# Altium schematic sheet Slave3_flying_pcb_v1.SchDoc
size A4
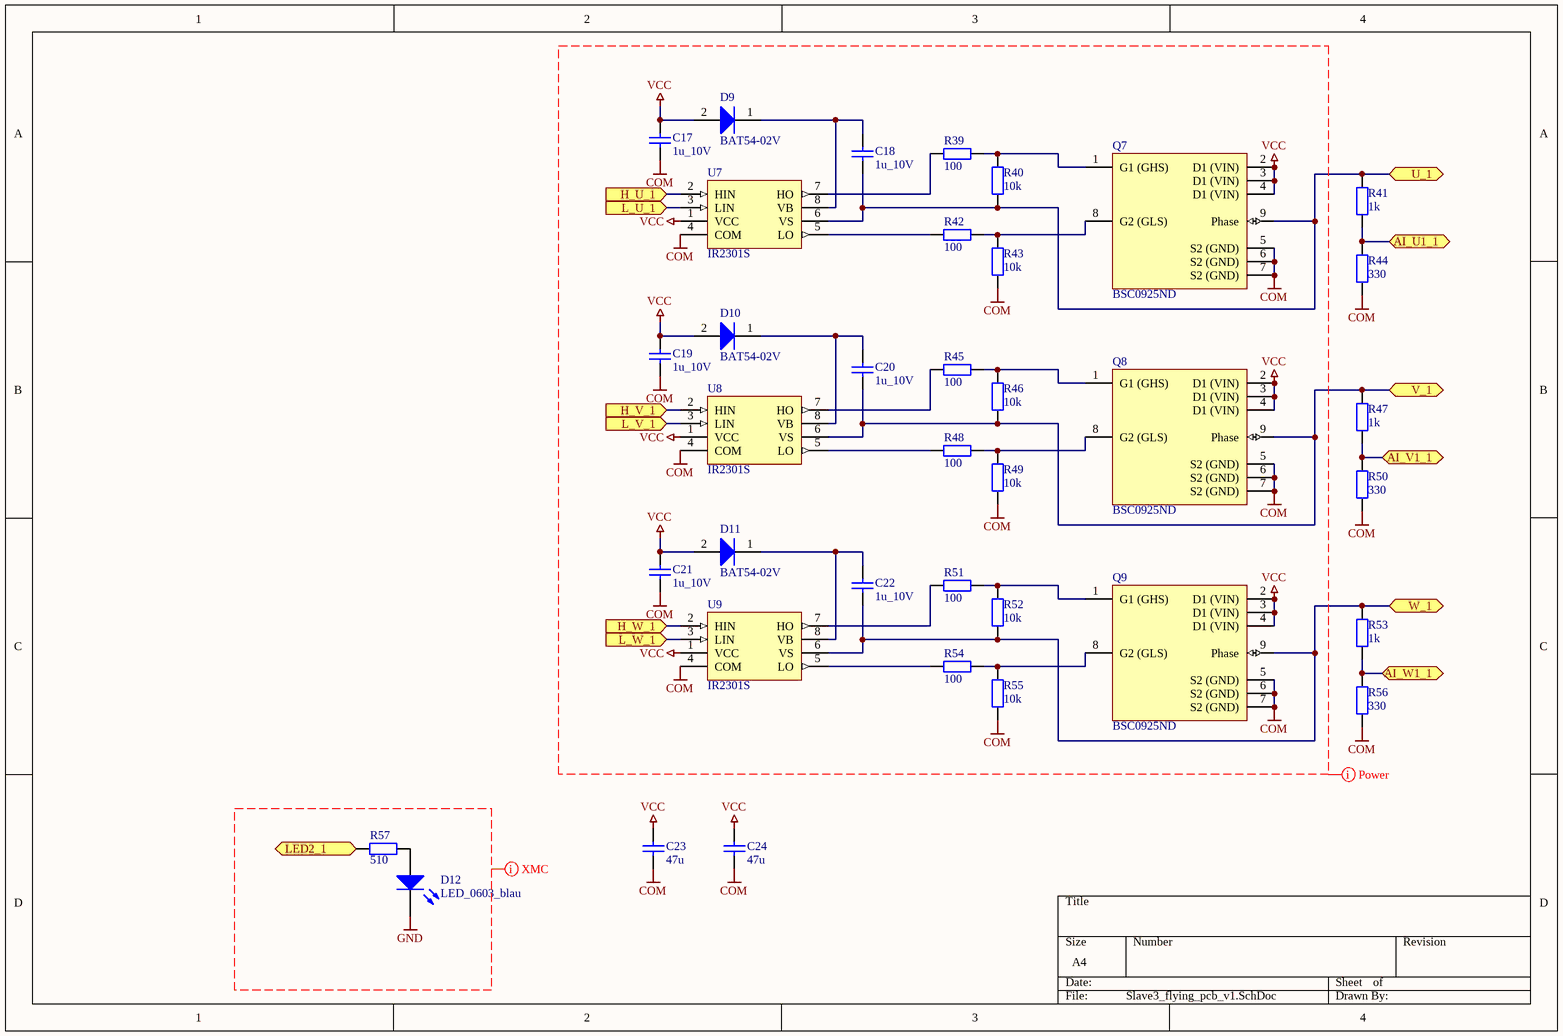
[diagram p0: Slave3_flying_pcb_v1.SchDoc]

## Parts
C17  1u_10V  [1608[0603]]
C18  1u_10V  [1608[0603]]
C19  1u_10V  [1608[0603]]
C20  1u_10V  [1608[0603]]
C21  1u_10V  [1608[0603]]
C22  1u_10V  [1608[0603]]
C23  47u  [_0805]
C24  47u  [_0805]
D9  BAT54-02V  [INF-SC79_V]
D10  BAT54-02V  [INF-SC79_V]
D11  BAT54-02V  [INF-SC79_V]
D12  LED_0603_blau  [LED_0603]
Q7  BSC0925ND  [INF-PG-TISON-8_V]
Q8  BSC0925ND  [INF-PG-TISON-8_V]
Q9  BSC0925ND  [INF-PG-TISON-8_V]
R39  value 100  [1608[0603]]  (hidden comment: Res_0603)
R40  value 10k  [1608[0603]]  (hidden comment: Res_0603)
R41  value 1k  [1608[0603]]  (hidden comment: Res_0603)
R42  value 100  [1608[0603]]  (hidden comment: Res_0603)
R43  value 10k  [1608[0603]]  (hidden comment: Res_0603)
R44  value 330  [1608[0603]]  (hidden comment: Res_0603)
R45  value 100  [1608[0603]]  (hidden comment: Res_0603)
R46  value 10k  [1608[0603]]  (hidden comment: Res_0603)
R47  value 1k  [1608[0603]]  (hidden comment: Res_0603)
R48  value 100  [1608[0603]]  (hidden comment: Res_0603)
R49  value 10k  [1608[0603]]  (hidden comment: Res_0603)
R50  value 330  [1608[0603]]  (hidden comment: Res_0603)
R51  value 100  [1608[0603]]  (hidden comment: Res_0603)
R52  value 10k  [1608[0603]]  (hidden comment: Res_0603)
R53  value 1k  [1608[0603]]  (hidden comment: Res_0603)
R54  value 100  [1608[0603]]  (hidden comment: Res_0603)
R55  value 10k  [1608[0603]]  (hidden comment: Res_0603)
R56  value 330  [1608[0603]]  (hidden comment: Res_0603)
R57  value 510  [1608[0603]]  (hidden comment: Res_0603)
U7  IR2301S  [SO-8_N]
U8  IR2301S  [SO-8_N]
U9  IR2301S  [SO-8_N]

## Ports
AI_U1_1 (bidir), AI_V1_1 (bidir), AI_W1_1 (bidir), H_U_1, H_V_1, H_W_1, L_U_1, L_V_1, L_W_1, LED2_1, U_1 (bidir), V_1 (bidir), W_1 (bidir)

## Nets
COM: C17.2 C19.2 C21.2 C23.1 C24.1 Q7.5(S2_(GND)) Q7.6(S2_(GND)) Q7.7(S2_(GND)) Q8.5(S2_(GND)) Q8.6(S2_(GND)) Q8.7(S2_(GND)) Q9.5(S2_(GND)) Q9.6(S2_(GND)) Q9.7(S2_(GND)) R43.2 R44.2 R49.2 R50.2 R55.2 R56.2 U7.4(COM) U8.4(COM) U9.4(COM)
GND: D12.2
VCC: C17.1 C19.1 C21.1 C23.2 C24.2 D9.2(A) D10.2(A) D11.2(A) Q7.2(D1_(VIN)) Q7.3(D1_(VIN)) Q7.4(D1_(VIN)) Q8.2(D1_(VIN)) Q8.3(D1_(VIN)) Q8.4(D1_(VIN)) Q9.2(D1_(VIN)) Q9.3(D1_(VIN)) Q9.4(D1_(VIN)) U7.1(VCC) U8.1(VCC) U9.1(VCC)
AI_U1_1: R41.2 R44.1 ; port AI_U1_1
AI_V1_1: R47.2 R50.1 ; port AI_V1_1
AI_W1_1: R53.2 R56.1 ; port AI_W1_1
H_U_1: U7.2(HIN) ; port H_U_1
H_V_1: U8.2(HIN) ; port H_V_1
H_W_1: U9.2(HIN) ; port H_W_1
L_U_1: U7.3(LIN) ; port L_U_1
L_V_1: U8.3(LIN) ; port L_V_1
L_W_1: U9.3(LIN) ; port L_W_1
LED2_1: R57.1 ; port LED2_1
U_1: C18.2 Q7.9(Phase) R40.2 R41.1 U7.6(VS) ; port U_1
V_1: C20.2 Q8.9(Phase) R46.2 R47.1 U8.6(VS) ; port V_1
W_1: C22.2 Q9.9(Phase) R52.2 R53.1 U9.6(VS) ; port W_1
NetC18_1: C18.1 D9.1(K) U7.8(VB)
NetC20_1: C20.1 D10.1(K) U8.8(VB)
NetC22_1: C22.1 D11.1(K) U9.8(VB)
NetD12_1: D12.1 R57.2
NetQ7_1: Q7.1(G1_(GHS)) R39.1 R40.1
NetQ7_8: Q7.8(G2_(GLS)) R42.1 R43.1
NetQ8_1: Q8.1(G1_(GHS)) R45.1 R46.1
NetQ8_8: Q8.8(G2_(GLS)) R48.1 R49.1
NetQ9_1: Q9.1(G1_(GHS)) R51.1 R52.1
NetQ9_8: Q9.8(G2_(GLS)) R54.1 R55.1
NetR39_2: R39.2 U7.7(HO)
NetR42_2: R42.2 U7.5(LO)
NetR45_2: R45.2 U8.7(HO)
NetR48_2: R48.2 U8.5(LO)
NetR51_2: R51.2 U9.7(HO)
NetR54_2: R54.2 U9.5(LO)

## Layout directives
net class Power: COM, VCC
net class XMC: GND

## Library data of the parts
C17-C22 = Cap_133: RS_number: 788-2884; QR: 0; Capacity: 1u; Voltage: 10V; UID: Cap_133; Name: 1u_10V; Name_Hyperlink: http://at.rs-online.com/web/p/keramik-multilayer-kondensatoren/7882884; ComponentLink1URL: #NAME?; mounting: SMD
C23 C24 = Cap_133: Name: Cap_cer_1u_50V; Capacity: 1u; Voltage: 50V; RS_number: 723-6350; QR: 0; UID: Cap_133; ComponentLink1URL: #NAME?; mounting: SMD; Name_Hyperlink: http://at.rs-online.com/web/p/keramik-multilayer-kondensatoren/7236350/
D9-D11 = BAT54-02V: Silicon Schottky Diode, SC79, Reel, Green; Manufacturer: Infineon; Green: TRUE; PackageReference: SC79; PackageDescription: 2-Pin Semiconductor Package, 0.8 x 1.2 mm Body; Supplier 1: Mouser; Supplier Part Number 1: N/A; Halogen-free: FALSE; Mounting Technology: Surface Mount; PartNumber: BAT54-02V; ComponentLink1Description: Manufacturer URL; ComponentLink1URL: http://www.infineon.com/; ComponentLink2Description: Datasheet; ComponentLink2URL: http://www.infineon.com/dgdl/bat54series.pdf?folderId=db3a30431400ef68011425f1ca2505e3&fileId=db3a304314dca3890115190b74210ea6; ComponentLink3Description: Package Specification; ComponentLink3URL: http://www.infineon.com/dgdl/SC79-Package_Overview.pdf?folderId=db3a30431936bc4b011951fbddb03b15&fileId=db3a30431936bc4b01195226fe583b41
D12 = DIODE_60: Type: LED; Colour: blau; RS_number: 697-3610P; QR: 0; UID: DIODE_60; Name: LED_0603_blau; Name_Hyperlink: http://at.rs-online.com/web/p/products/6973610P/; ComponentLink1URL: #WERT!; mounting: SMD
Q7-Q9 = BSC0925ND: N-Channel OptiMOS Power-MOSFET, 30 V VDS, 40 A ID, -55 to 150 degC, PG-TISON-8, Reel, Green; Manufacturer: Infineon; Green: TRUE; ID (max): 40 A; IDpuls (max): 160 A; Polarity: N; Ptot (max): 30 W; QG: 6.7 nC; RDS (on) (max): 5 mOhm; RDS (on) (max) (@4.5V): 7 mOhm; Rth: 4.2 K/W; RthJA (max): 125 K/W; VDS (max): 30 V; VGS(th) (max): 2 V; VGS(th) (min): 1.2 V; DatasheetVersion: Rev. 1.0; PackageVersion: Rev. 01, 09/2011; PackageReference: PG-TISON-8; PackageDescription: 8-Pin Plastic (Green) Small Outline Non-Leaded Package, 5 x 6 mm Body, 1.27 mm Pitch; Halogen-free: TRUE; Packing: Reel; RthJC (max): 4.2 K/W; Mounting Technology: Surface Mount; PartNumber: BSC0925ND; ComponentLink1Description: Manufacturer URL; ComponentLink1URL: http://www.infineon.com/; ComponentLink2Description: Datasheet; ComponentLink2URL: http://www.infineon.com/dgdl/BSC0925ND_rev1+0.pdf?folderId=db3a304313b8b5a60113cee8763b02d7&fileId=db3a304336ca04c90136cec562a24914; ComponentLink3Description: Package Specification; ComponentLink3URL: http://www.infineon.com/dgdl/BSC0910NDI_Rev. 0.5.pdf?folderId=db3a304313b8b5a60113cee8763b02d7&fileId=db3a304336ca04c90136cedc08b64926
R39-R57 = Res_6: UID: Res_6; Name: Res_0603; ComponentLink1URL: #NAME?; mounting: SMD
U7-U9 = IR2101S: High and Low Side Driver; Published: 8-Jun-2000; LatestRevisionDate: 13-Apr-2006; LatestRevisionNote: IPC-7351 Footprint Added.; DatasheetVersion: PD60043J; PackageVersion: Feb-2001; PackageReference: SO-8; Publisher: Altium Limited; PackageDescription: 8-Pin Plastic Small Outline Integrated Circuit 1.27 mm Pitch; Code_JEDEC: MS-012-AA; Code_IPC: SOIC127P600-8; ComponentLink1Description: Manufacturer Link; ComponentLink1URL: http://www.irf.com/